# Altium schematic sheet 02_Top_Level.SchDoc: <Project Name>
size A3; ApprovedBy: <Appr.>; Author: <Author>; CompanyName: Infineon Technologies AG; Engineer: <Rel.>; Organization: Infineon Technologies AG; Address1: COM AC SDC SD3; Address2: Am Campeon 1-12  -  85579 Neubiberg  -  Germany; Address3: 85579 Neubiberg; Address4: Germany; DocumentNumber: 2; Revision: <Rev.>; SheetNumber: 2; SheetTotal: 9; Release: RC00; PageSetup: Record=PageOptions|CenterHorizontal=True|CenterVertical=True|PrintScale=1.01|XCorrection=1.00|YCorrection=1.00|PrintKind=0|BorderSize=5000000|LeftOffset=0|BottomOffset=0|Orientation=2|PaperLength=1000|PaperWidth=1000|Scale=100|PaperSource=7|PrintQuality=-4|MediaType=1|DitherType=10|PaperKind=A3|PrintScaleMode=1; Doc_ConfidentialStatus: <Doc_ConfidentialStatus>; Doc_Preliminary: <Doc_Preliminary>
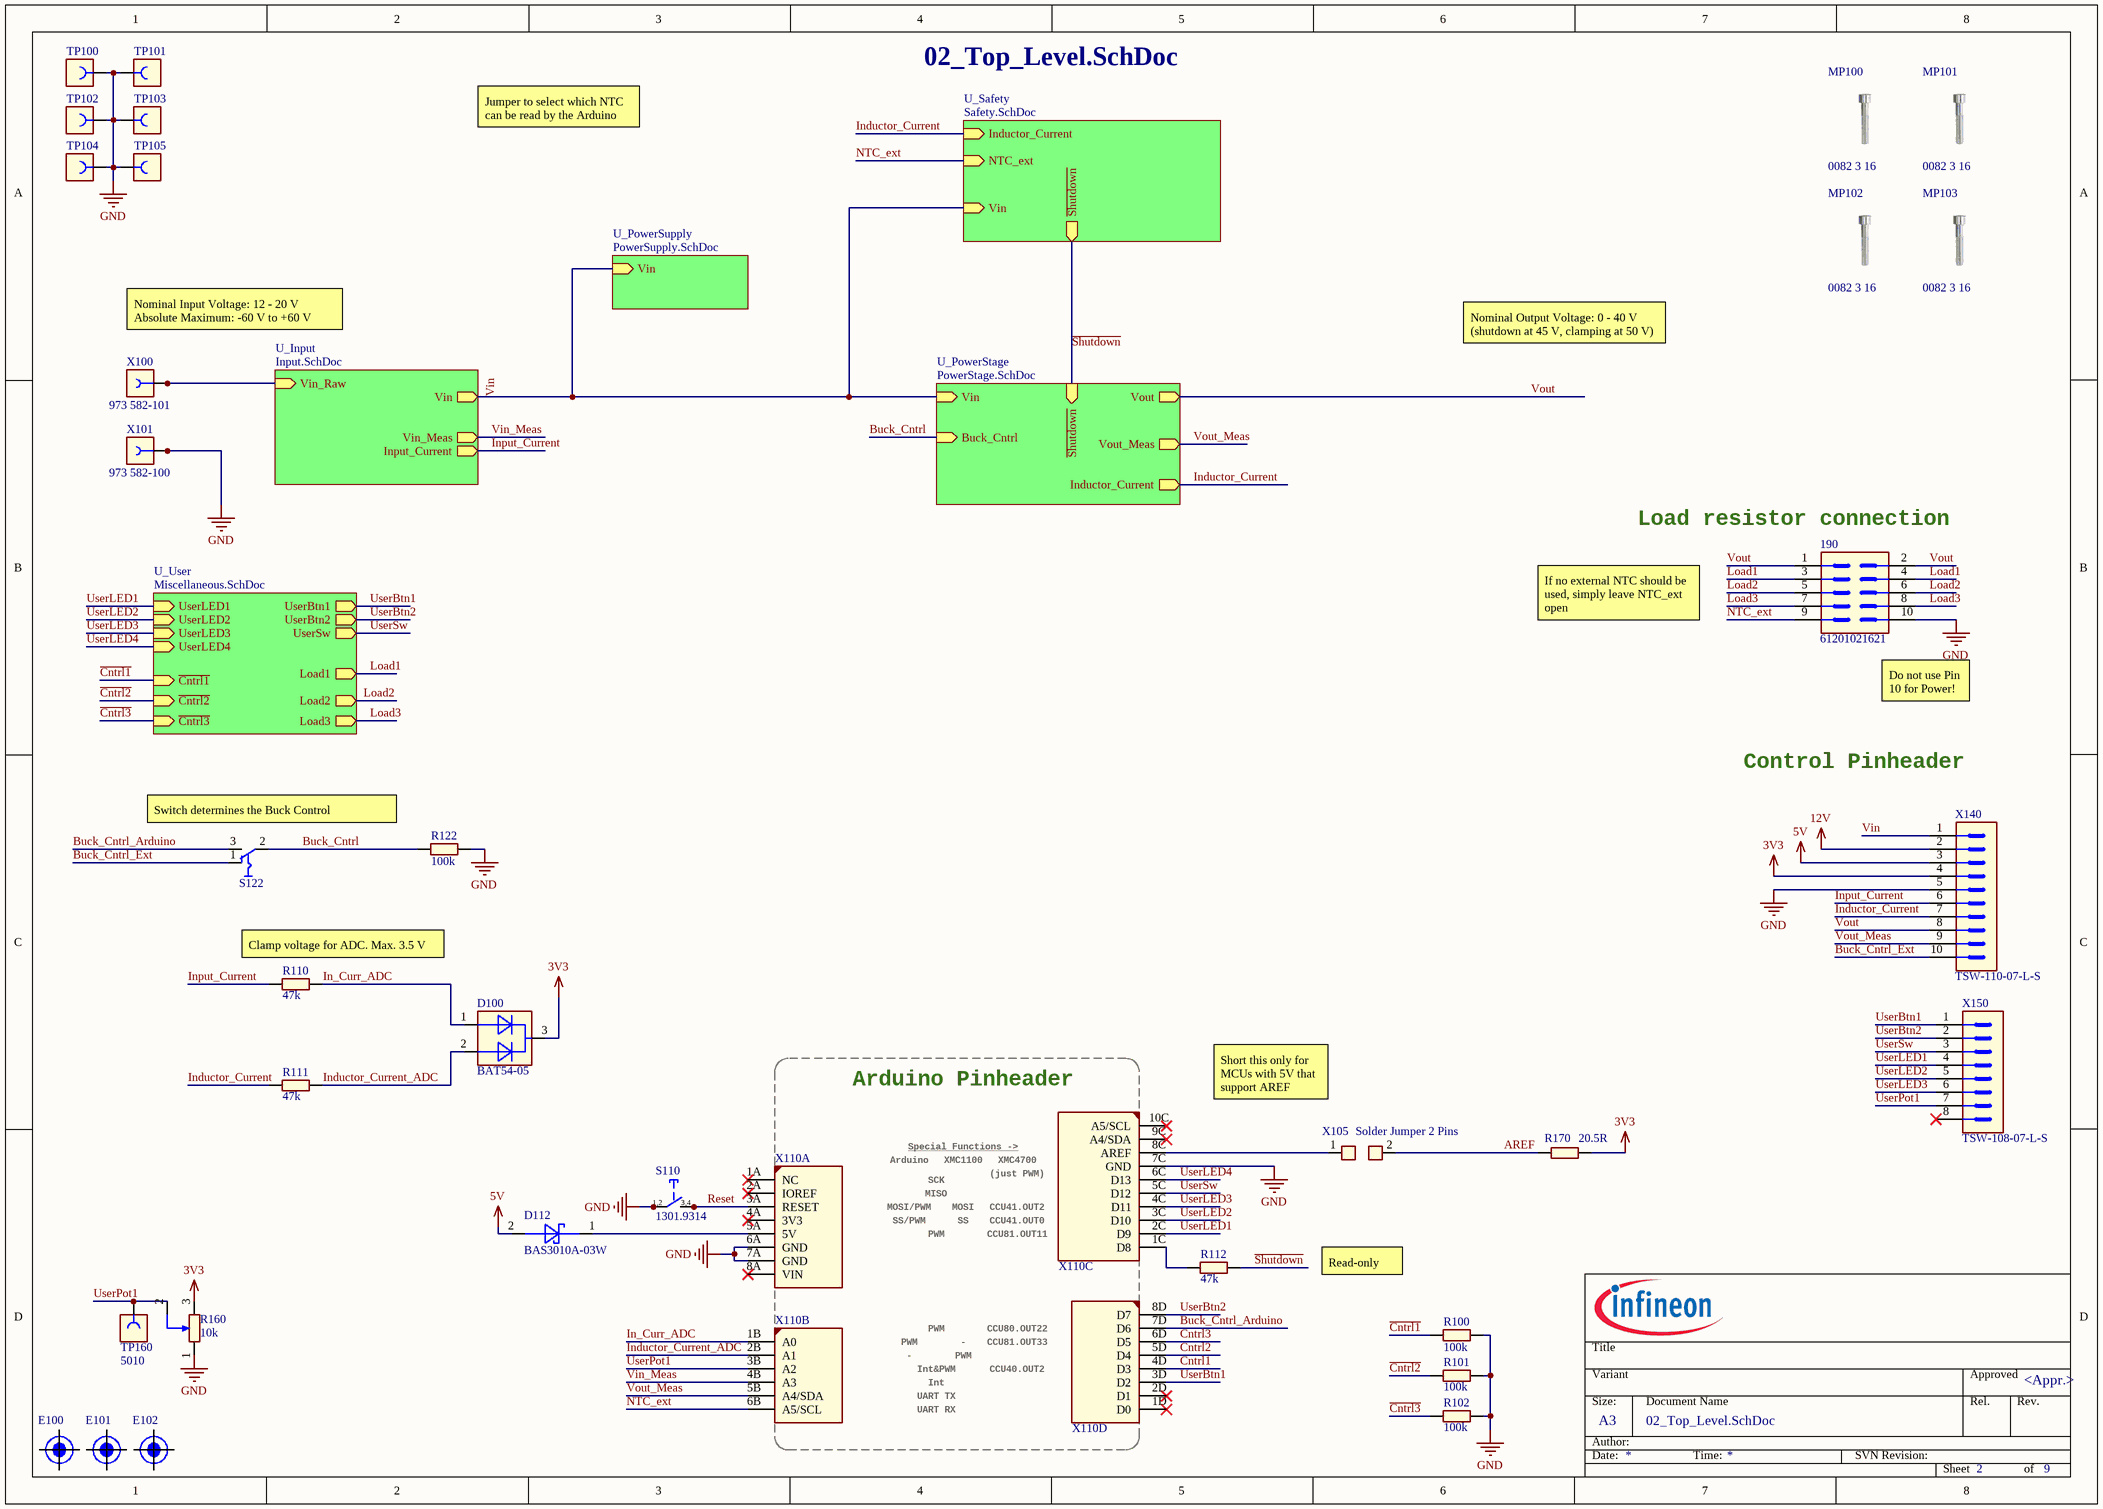
[diagram p0: 02_Top_Level.SchDoc]

## Parts
190  61201021621  [CON-M-THT-61201021621]
D100  BAT54-05  [SOT95P240X110-3N-1-V]
D112  BAS3010A-03W  [SOD2513X110N]
E100  (no value)  [fiducial]  (no BOM)
E101  (no value)  [fiducial]  (no BOM)
E102  (no value)  [fiducial]  (no BOM)
MP100  0082 3 16  [SCREW_0082 3 16_NPTH]
MP101  0082 3 16  [SCREW_0082 3 16_NPTH]
MP102  0082 3 16  [SCREW_0082 3 16_NPTH]
MP103  0082 3 16  [SCREW_0082 3 16_NPTH]
R100  100k  [RESC3216X60N]
R101  100k  [RESC3216X60N]
R102  100k  [RESC3216X60N]
R110  47k  [RESC3216X60N]
R111  47k  [RESC3216X60N]
R112  47k  [RESC3216X60N]
R122  100k  [RESC3216X60N]
R160  10k  [POT-THT-3362P]
R170  20.5R  [RESC3216X60N]
S110  1301.9314  [SW-SMD-1301.9314]
S122  CL-SB-12A-01T  [SW-SMD-CL-SB-12A-01T]  (value not drawn)
TP100  5011  [CON-THT-TP-5011]  (value not drawn)
TP101  5011  [CON-THT-TP-5011]  (value not drawn)
TP102  5011  [CON-THT-TP-5011]  (value not drawn)
TP103  5011  [CON-THT-TP-5011]  (value not drawn)
TP104  5011  [CON-THT-TP-5011]  (value not drawn)
TP105  5011  [CON-THT-TP-5011]  (value not drawn)
TP160  5010  [CON-THT-TP-5010]
X100  973 582-101  [CON-THT-973 582- 101]
X101  973 582-100  [CON-THT-973 582- 100]
X105  Solder Jumper 2 Pins  [SOLDER_BRIDGE_0.7X1.299PAD]
X110  Arduino-Uno  [Arduino-Uno]  (value not drawn)  (parts A,B,C,D of 4)
X140  TSW-110-07-L-S  [CON-M-THT-TSW-110-07-L-S]
X150  TSW-108-07-L-S  [CON-M-THT-TSW-108-07-L-S]

## Sub-sheets
U_Input = Input.SchDoc: Vin_Raw (in), Vin (out), Vin_Meas (out), Input_Current (out)
U_PowerStage = PowerStage.SchDoc: Vin (in), ~{Shutdown} (in), Buck_Cntrl (in), Vout (out), Inductor_Current (out), Vout_Meas (out)
U_PowerSupply = PowerSupply.SchDoc: Vin (in)
U_Safety = Safety.SchDoc: ~{Shutdown} (out), NTC_ext (in), Inductor_Current (in), Vin (in)
U_User = Miscellaneous.SchDoc: UserLED1 (in), UserLED2 (in), UserLED3 (in), UserLED4 (in), UserBtn1 (out), UserBtn2 (out), UserSw (out), Load3 (out), ~{Cntrl1} (in), ~{Cntrl3} (in), Load2 (out), Load1 (out), ~{Cntrl2} (in)

## Nets
3V3: D100.3(CATHODE) R160.3 R170.2 X140.4
5V: D112.2(Anode) X140.3
12V: X140.2
GND: 190.10 R100.2 R101.2 R102.2 R122.2 R160.1 S110.1 S110.2 TP100.1 TP101.1 TP102.1 TP103.1 TP104.1 TP105.1 X101.1 X101.2 X110.6A(GND) X110.7A(GND) X110.7C(GND) X140.5
~{Cntrl1}: R100.1 X110.4D(D3) ; sheet U_User/~{Cntrl1}
~{Cntrl2}: R101.1 X110.5D(D4) ; sheet U_User/~{Cntrl2}
~{Cntrl3}: R102.1 X110.6D(D5) ; sheet U_User/~{Cntrl3}
~{Shutdown}: R112.1 ; sheet U_PowerStage/~{Shutdown}, sheet U_Safety/~{Shutdown}
AREF: R170.1 X105.2
Buck_Cntrl: R122.1 S122.2 ; sheet U_PowerStage/Buck_Cntrl
Buck_Cntrl_Arduino: S122.3 X110.7D(D6)
Buck_Cntrl_Ext: S122.1 X140.10
In_Curr_ADC: D100.1(ANODE_1) R110.1 X110.1B(A0)
Inductor_Current: R111.2 X140.7 ; sheet U_PowerStage/Inductor_Current, sheet U_Safety/Inductor_Current
Inductor_Current_ADC: D100.2(ANODE_2) R111.1 X110.2B(A1)
Input_Current: R110.2 X140.6 ; sheet U_Input/Input_Current
Load1: 190.3 190.4 ; sheet U_User/Load1
Load2: 190.5 190.6 ; sheet U_User/Load2
Load3: 190.7 190.8 ; sheet U_User/Load3
NTC_ext: 190.9 X110.6B(A5/SCL) ; sheet U_Safety/NTC_ext
Reset: S110.3 S110.4 X110.3A(RESET)
UserBtn1: X110.3D(D2) X150.1 ; sheet U_User/UserBtn1
UserBtn2: X110.8D(D7) X150.2 ; sheet U_User/UserBtn2
UserLED1: X110.2C(D9) X150.4 ; sheet U_User/UserLED1
UserLED2: X110.3C(D10) X150.5 ; sheet U_User/UserLED2
UserLED3: X110.4C(D11) X150.6 ; sheet U_User/UserLED3
UserLED4: X110.6C(D13) ; sheet U_User/UserLED4
UserPot1: R160.2 TP160.1 X110.3B(A2) X150.7
UserSw: X110.5C(D12) X150.3 ; sheet U_User/UserSw
Vin: X140.1 ; sheet U_Input/Vin, sheet U_PowerStage/Vin, sheet U_PowerSupply/Vin, sheet U_Safety/Vin
Vin_Meas: X110.4B(A3) ; sheet U_Input/Vin_Meas
Vout: 190.1 190.2 X140.8 ; sheet U_PowerStage/Vout
Vout_Meas: X110.5B(A4/SDA) X140.9 ; sheet U_PowerStage/Vout_Meas
NetD112_1: D112.1(Cathode) X110.5A(5V)
NetR112_2: R112.2 X110.1C(D8)
NetX100_1: X100.1 X100.2 ; sheet U_Input/Vin_Raw
NetX105_1: X105.1 X110.8C(AREF)

Not connected (* = marked no-connect by the designer): E100 1; E101 1; E102 1; X110 1A(NC)* 1D(D0)* 2A(IOREF)* 2D(D1)* 4A(3V3)* 8A(VIN)* 9C(A4/SDA)* 10C(A5/SCL)*; X150 8*

## Notes on the sheet
- Jumper to select which NTC  can be read by the Arduino
- Nominal Input Voltage: 12 - 20 V
  Absolute Maximum: -60 V to +60 V
- Nominal Output Voltage: 0 - 40 V (shutdown at 45 V, clamping at 50 V)
- (near 190) Load resistor connection
- If no external NTC should be used, simply leave NTC_ext open
- (near 190) Do not use Pin 10 for Power!
- Control Pinheader
- Switch determines the Buck Control
- (near R110) Clamp voltage for ADC. Max. 3.5 V
- Arduino Pinheader
- Short this only for MCUs with 5V that support AREF
- Arduino
- SCK
- MISO
- Special Functions ->
- XMC1100
- XMC4700
- (just PWM)
- SS/PWM
- MOSI/PWM
- PWM
- MOSI
- SS
- CCU41.OUT0
- CCU41.OUT2
- CCU81.OUT11
- CCU80.OUT22
- Read-only
- -
- UART TX
- Int
- Int&PWM
- CCU81.OUT33
- CCU40.OUT2
- UART RX
- Title
- Variant
- Approved
- Date:
- Author:
- Size:
- A3
- Document Name
- Time:
- SVN Revision:
- Rel.
- Rev.
- Sheet
- of
- (in symbol 380147) 1,2; 3,4

## Library data of the parts
190 = 638630: WR-BHD Male Box Header, 2.54mm pitch, 10 pin, Vertical, Double row; Manufacturer: Wurth Elektronik; Article Number: 638630; Version Number: V01; Legacy DeviceID: WE_61201021621; Combined Parameters: Board-to-Board/Cable Header (male);5x2;Mounting:THT;Orient:0° (vertical);Shielded:No; QuickPick: 0° (vertical) / Board-to-Board/Cable; Style: Strip; Automotive Qualified: No; ComponentStatus: Released; PLMStatus: Active; Second Source allowed: Yes; Voltage DC (max): na; Part Type: Connector; Manufacturer Order Number: 61201021621; Value: 61201021621; Type: Board-to-Board/Cable; Temperature min: -40; Temperature max: 105; Temperature Range: Industrial; ROHS Compliant: Y; PackageReference: THT; ComponentLink1Description: Vendor WebSite; ComponentLink1URL: http://www.we-online.com; ComponentLink2Description: Datasheet; ComponentLink2URL: http://webnetprod.muc.infineon.com/PCBPortal_Prod/WorkFlows/AltiumComponent/StandardDocumentation?Versionid=638631; Supplier 1: Farnell; Supplier Part Number 1: 1642019; Supplier 2: DigiKey; Supplier Part Number 2: 732-2094-ND; Supplier 3: Mouser; Supplier Part Number 3: 710-61201021621; Package Description: Connector, THT, 2.54mm Pitch; 10 Pins, 9.10 mm L X 20.36 mm W X 9.25 mm H body
D100 = 430837: Silicon Schottky Diode, LS(nH) 1.8, VR 30V; Legacy PartNumber: IFX01401370; Manufacturer: Infineon Technologies; Symbol type: Dual Diode Symbol 3 Pins, 1 Anode, 2 Anode, 3 Cathode; Article Number: 430837; Version Number: V01; Combined Parameters: Vf:800mV;If:200mA;Ur:30V;Ir:2uA;Pmax:230mW; QuickPick: Schottky Diode / PG-SOT23-3-11; Style: Dual; Automotive Qualified: AEC Q101; ComponentStatus: Released; PLMStatus: Active; Second Source allowed: Yes; Voltage DC (max): na; Legacy DeviceID: IFX01401370; Part Type: Diode; Manufacturer Order Number: BAT54-05; Value: BAT54-05; Type: Schottky Diode; Application: Standard; Temperature min: 0; Temperature max: 150; Temperature Range: Military; ROHS Compliant: Y; PackageReference: PG-SOT23-3-11; ComponentLink1Description: Vendor WebSite; ComponentLink1URL: https://www.infineon.com/; ComponentLink2Description: Datasheet; ComponentLink2URL: http://webnetprod.muc.infineon.com/PCBPortal_Prod/WorkFlows/AltiumComponent/StandardDocumentation?Versionid=430838; Supplier 1: Farnell; Supplier Part Number 1: 2725759; Supplier 2: DigiKey; Supplier Part Number 2: BAT5405E6327HTSA1TR-ND; Supplier 3: Mouser; Supplier Part Number 3: 726-BAT5405E6327HTSA; Package Description: SOT,0.95mm pitch;3 pin,1.30mm W X 2.90mm L X 1.10mm H body
D112 = 420617: Medium Power AF Schottky Diode; Legacy PartNumber: IFX01400145; Manufacturer: Infineon Technologies; Symbol Type: Standard Schottky Diode Symbol, 1 Cathode, 2 Anode; Article Number: 420617; Version Number: V01; Combined Parameters: Vf:410mV;If:1A;Ur:30V;Ir:200uA;Pmax:-; QuickPick: Schottky Diode / SOD323; Style: Single; Automotive Qualified: AEC Q101; ComponentStatus: Released; PLMStatus: Active; Second Source allowed: Yes; Voltage DC (max): na; Legacy DeviceID: IFX01400145; Part Type: Diode; Manufacturer Order Number: BAS3010A-03W; Value: BAS3010A-03W; Type: Schottky Diode; Application: Standard; Temperature min: -65; Temperature max: 125; Temperature Range: Military; ROHS Compliant: Y; PackageReference: SOD323; ComponentLink1Description: Vendor WebSite; ComponentLink1URL: https://www.infineon.com/; ComponentLink2Description: Datasheet; ComponentLink2URL: http://webnetprod.muc.infineon.com/PCBPortal_Prod/WorkFlows/AltiumComponent/StandardDocumentation?Versionid=420618; Supplier 1: Farnell; Supplier 2: DigiKey; Supplier Part Number 2: BAS3010A03WE6327HTSA1TR-ND; Supplier 3: Mouser; Supplier Part Number 3: 726-BAS3010A-03WE6; Package Description: SOD323
E100-E102 = 416637: Fiducial Mark; Legacy PartNumber: MEC10000008; Manufacturer: Infineon Technologies; Alternate View: No; Symbol Type: Fiducial Marker For PCB; Article Number: 416637; Version Number: V01; Legacy DeviceID: MEC_Fiducial_Mark; Combined Parameters: - - -x- -; ComponentStatus: Released; PLMStatus: Active; Second Source allowed: Yes; Voltage DC (max): na; Multible Parts: No; Part Type: Mechanical; Temperature min: 0; Temperature max: 0; Temperature Range: Military; ComponentLink1Description: Vendor WebSite; ComponentLink1URL: https://www.infineon.com/; ComponentLink2Description: Datasheet; ComponentLink2URL: http://webnetprod.muc.infineon.com/PCBPortal_Prod/WorkFlows/AltiumComponent/StandardDocumentation?Versionid=416638; Supplier 1: Farnell; Supplier 2: DigiKey; Supplier 3: Mouser
MP100-MP103 = 455343: Cheese Head Screw With Hexagon Socket, DIN 912 (ISO 4762), M3, 16mm length; Legacy PartNumber: MEC10000167; Manufacturer: Wurth Elektronik; Alternate View: No; Symbol Type: Cheese-Head Screw, M2.5X5-DIN 912; Article Number: 455343; Version Number: V01; Legacy DeviceID: MEC_0082 3 16; Combined Parameters: Steel Hexagonal 19x5.68 Screw; Style: Hexagonal; ComponentStatus: Released; PLMStatus: Active; Second Source allowed: Yes; Voltage DC (max): na; Multiple Parts: No; Part Type: Mechanical; Manufacturer Order Number: 0082 3 16; Value: 0082 3 16; QuickPick: Screw; Type: Screw; Temperature min: 0; Temperature max: 0; Temperature Range: Military; ROHS Compliant: N; Automotive Qualified: No; PackageReference: THT; ComponentLink1Description: Vendor WebSite; ComponentLink1URL: http://www.we-online.com; ComponentLink2Description: Datasheet; ComponentLink2URL: http://webnetprod.muc.infineon.com/PCBPortal_Prod/WorkFlows/AltiumComponent/StandardDocumentation?Versionid=455344; Supplier 1: Farnell; Supplier 2: DigiKey; Supplier 3: Mouser; Package Description: M3 Cheese Head Screw X 5.68mm Head
R100-R102 R122 = 354752: RES / STD / 100k / 250mW / 1% / 100ppm/K / -55°C to 155°C / 1206(3216) / SMD / -; Multiple Parts: No; Legacy PartNumber: RES01802971; Manufacturer: Vishay; Manufacturer Order Number: CRCW1206100KFK; Symbol Type: Resistor; Single; Standard; 2 Pins; Alternate View: Yes; Article Number: 354752; Version Number: V01; Combined Parameters: TCR:100ppm/K;Tol.:-1%/+1%;Vdc:200V;Idc:-;P:250mW; QuickPick: 100k / 1% / 0.25 / 1206 (3216); Style: Single; Automotive Qualified: AEC Q200; Package Metric: 3216; Package Imperial: 1206; ComponentStatus: Released; PLMStatus: Active; Voltage DC (max): 200V; Legacy DeviceID: RES01802971; Part Type: Resistor; Value: 100k; Tolerance Neg: 1%; Tolerance Pos: 1%; Type: Standard; Technology: Thick Film; Temperature min: -55; Temperature max: 155; Temperature Range: Military; ROHS Compliant: Y; PackageReference: 1206 (3216); ComponentLink1Description: Vendor WebSite; ComponentLink1URL: http://www.vishay.com; ComponentLink2Description: Datasheet; ComponentLink2URL: http://webnetprod.muc.infineon.com/PCBPortal_Prod/WorkFlows/AltiumComponent/StandardDocumentation?Versionid=354753; Supplier 1: Farnell; Supplier 2: DigiKey; Supplier 3: Mouser; Second Source allowed: Yes
R110-R112 = 354562: RES / STD / 47k / 250mW / 1% / 100ppm/K / -55°C to 155°C / 1206(3216) / SMD / -; Multiple Parts: No; Legacy PartNumber: RES01802933; Manufacturer: Vishay; Manufacturer Order Number: CRCW120647K0FK; Symbol Type: Resistor; Single; Standard; 2 Pins; Alternate View: Yes; Article Number: 354562; Version Number: V01; Combined Parameters: TCR:100ppm/K;Tol.:-1%/+1%;Vdc:200V;Idc:-;P:250mW; QuickPick: 47k / 1% / 0.25 / 1206 (3216); Style: Single; Automotive Qualified: AEC Q200; Package Metric: 3216; Package Imperial: 1206; ComponentStatus: Released; PLMStatus: Active; Voltage DC (max): 200V; Legacy DeviceID: RES01802933; Part Type: Resistor; Value: 47k; Tolerance Neg: 1%; Tolerance Pos: 1%; Type: Standard; Technology: Thick Film; Temperature min: -55; Temperature max: 155; Temperature Range: Military; ROHS Compliant: Y; PackageReference: 1206 (3216); ComponentLink1Description: Vendor WebSite; ComponentLink1URL: http://www.vishay.com; ComponentLink2Description: Datasheet; ComponentLink2URL: http://webnetprod.muc.infineon.com/PCBPortal_Prod/WorkFlows/AltiumComponent/StandardDocumentation?Versionid=354563; Supplier 1: Farnell; Supplier 2: DigiKey; Supplier 3: Mouser; Second Source allowed: Yes
R160 = 647233: RES / VAR / 10k / 500mW / 10% / 100ppm/K / -55°C to 125°C / Potentiometer, THT, 2.54 mm pitch, 3 pin, 6.60 mm L X 6.99 mm W X 15.06 mm H body / THT / -; Multiple Parts: No; Manufacturer: Bourns; Manufacturer Order Number: 3362P-1-103T_LF; Alternate View: Yes; Symbol Type: Resistor; Single; Variable; 3 Pins; Article Number: 647233; Version Number: V01; Combined Parameters: TCR:100ppm/K;Tol.:-10%/+10%;Vdc:300V;Idc:-;P:500mW; QuickPick: 10k / 10% / 0.5 / THT; Style: Single; ComponentStatus: Released; PLMStatus: Active; Voltage DC (max): 300V; Part Type: Resistor; Value: 10k; Tolerance Neg: 10%; Tolerance Pos: 10%; Type: Variable; Application: Standard; Temperature min: -55; Temperature max: 125; Temperature Range: Military; ROHS Compliant: Y; Automotive Qualified: No; PackageReference: THT; ComponentLink1Description: Vendor WebSite; ComponentLink1URL: http://www.bourns.com; ComponentLink2Description: Datasheet; ComponentLink2URL: http://webnetprod.muc.infineon.com/PCBPortal_Prod/WorkFlows/AltiumComponent/StandardDocumentation?Versionid=647234; Supplier 1: Farnell; Supplier Part Number 1: 1739325; Supplier 2: DigiKey; Supplier Part Number 2: 3362P-103TLF-ND; Supplier 3: Mouser; Supplier Part Number 3: 652-3362P-1-103TLF; Second Source allowed: Yes; Package Description: Potentiometer, THT, 2.54 mm pitch, 3 pin, 6.60 mm L X 6.99 mm W X 15.06 mm H body
R170 = 352637: RES / STD / 20.5R / 250mW / 1% / 100ppm/K / -55°C to 155°C / 1206(3216) / SMD / -; Multiple Parts: No; Legacy PartNumber: RES01802548; Manufacturer: Vishay; Manufacturer Order Number: CRCW120620R5FK; Symbol Type: Resistor; Single; Standard; 2 Pins; Alternate View: Yes; Article Number: 352637; Version Number: V01; Combined Parameters: TCR:100ppm/K;Tol.:-1%/+1%;Vdc:200V;Idc:-;P:250mW; QuickPick: 20.5R / 1% / 0.25 / 1206 (3216); Style: Single; Automotive Qualified: AEC Q200; Package Metric: 3216; Package Imperial: 1206; ComponentStatus: Released; PLMStatus: Active; Voltage DC (max): 200V; Legacy DeviceID: RES01802548; Part Type: Resistor; Value: 20.5R; Tolerance Neg: 1%; Tolerance Pos: 1%; Type: Standard; Technology: Thick Film; Temperature min: -55; Temperature max: 155; Temperature Range: Military; ROHS Compliant: Y; PackageReference: 1206 (3216); ComponentLink1Description: Vendor WebSite; ComponentLink1URL: http://www.vishay.com; ComponentLink2Description: Datasheet; ComponentLink2URL: http://webnetprod.muc.infineon.com/PCBPortal_Prod/WorkFlows/AltiumComponent/StandardDocumentation?Versionid=352638; Supplier 1: Farnell; Supplier 2: DigiKey; Supplier 3: Mouser; Second Source allowed: Yes
S110 = 380147: Pushbutton Tactile Switch, Single Pole Single Throw, 4 Pins; Legacy PartNumber: CON01500305; Manufacturer: Schurter; Symbol type: Tactile Switch, Spring Return, Single Pole Single Throw - Normally Open, 4 Pins; Article Number: 380147; Version Number: V01; Legacy DeviceID: SCH_1301.9314; ComponentStatus: Released; PLMStatus: Active; Second Source allowed: Yes; Voltage DC (max): na; Part Type: Electro Mechanic; Manufacturer Order Number: 1301.9314; Value: 1301.9314; Temperature min: -20; Temperature max: 70; Temperature Range: Commercial; ROHS Compliant: Y; ComponentLink1Description: Vendor WebSite; ComponentLink1URL: http://www.schurter.com.sg/; ComponentLink2Description: Datasheet; ComponentLink2URL: http://webnetprod.muc.infineon.com/PCBPortal_Prod/WorkFlows/AltiumComponent/StandardDocumentation?Versionid=380148; Supplier 1: Farnell; Supplier Part Number 1: 1217763; Supplier 2: DigiKey; Supplier Part Number 2: 1301.9314-ND; Supplier 3: Mouser; Supplier Part Number 3: 693-1301.9314; Package Description: SMD Switch, 6.00mm L X 6.00mm W X 4.3mm H body
S122 = 650099: Slid Switch, 12V, 200mA; Manufacturer: NIDEC COPAL ELECTRONICS, Inc.; Symbol Type: Switch, 2 Change Over 1 3, 3 Pins; Article Number: 650099; Version Number: V00; Automotive Qualified: No; ComponentStatus: Released; PLMStatus: Active; Second Source allowed: Yes; Voltage DC (max): na; Part Type: Electro Mechanic; Manufacturer Order Number: CL-SB-12A-01T; Value: CL-SB-12A-01T; Application: Power; Temperature min: -40; Temperature max: 85; Temperature Range: Industrial; ROHS Compliant: Y; ComponentLink1Description: Vendor WebSite; ComponentLink1URL: www.copal-electronics.com/; ComponentLink2Description: Datasheet; ComponentLink2URL: http://webnetprod.muc.infineon.com/PCBPortal_Prod/WorkFlows/AltiumComponent/StandardDocumentation?Versionid=650100; Supplier 1: Farnell; Supplier Part Number 1: 2854744; Supplier 2: DigiKey; Supplier Part Number 2: 563-1314-1-ND; Supplier 3: Mouser; Supplier Part Number 3: 229-CL-SB-12A-01T; Package Description: Switch, SMD, 3 Pins, 3.50 mm W X 8.50 mm L X 6.10 mm H body
TP100-TP105 = 382410: PC Test Point-Multipurpose THT, Black; Multiple Parts: No; Legacy PartNumber: CON01500530; Manufacturer: Keystone Electronics Corp.; Symbol Type: Connector, 1 Lead, Female; Alternate View: Yes; Article Number: 382410; Version Number: V01; Legacy DeviceID: KEY_5011; Combined Parameters: Board-to-Cable None (onboard);1x1;Mounting:THT;Orient:0° (vertical);Shielded:No; QuickPick: 0° (vertical) / Board-to-Cable; Style: Not Applicable; ComponentStatus: Released; PLMStatus: Active; Voltage DC (max): na; Part Type: Connector; Manufacturer Order Number: 5011; Value: 5011; Type: Board-to-Cable; Application: Test; Temperature min: 0; Temperature max: 0; Temperature Range: Military; ROHS Compliant: Y; Automotive Qualified: No; ComponentLink1Description: Vendor WebSite; ComponentLink1URL: http://www.keyelco.com/; ComponentLink2Description: Datasheet; ComponentLink2URL: http://webnetprod.muc.infineon.com/PCBPortal_Prod/WorkFlows/AltiumComponent/StandardDocumentation?Versionid=382411; Supplier 1: Farnell; Supplier Part Number 1: 2431148; Supplier 2: DigiKey; Supplier Part Number 2: 36-5011-ND; Supplier 3: Mouser; Supplier Part Number 3: 534-5011; Second Source allowed: Yes; Package Description: Test Point, 1.78 mm Lead Width, Round, 3.17 mm Dia X 8.28 mm H body
TP160 = 382400: PC Test Point-Multipurpose THT, Red; Multiple Parts: No; Legacy PartNumber: CON01500529; Manufacturer: Keystone Electronics Corp.; Symbol Type: Connector, 1 Lead, Female; Alternate View: Yes; Article Number: 382400; Version Number: V01; Legacy DeviceID: KEY_5010; Combined Parameters: Board-to-Cable None (onboard);1x1;Mounting:THT;Orient:0° (vertical);Shielded:No; QuickPick: 0° (vertical) / Board-to-Cable; Style: Not Applicable; ComponentStatus: Released; PLMStatus: Active; Voltage DC (max): na; Part Type: Connector; Manufacturer Order Number: 5010; Value: 5010; Type: Board-to-Cable; Application: Test; Temperature min: 0; Temperature max: 0; Temperature Range: Military; ROHS Compliant: Y; Automotive Qualified: No; ComponentLink1Description: Vendor WebSite; ComponentLink1URL: http://www.keyelco.com/; ComponentLink2Description: Datasheet; ComponentLink2URL: http://webnetprod.muc.infineon.com/PCBPortal_Prod/WorkFlows/AltiumComponent/StandardDocumentation?Versionid=382401; Supplier 1: Farnell; Supplier Part Number 1: 2301288; Supplier 2: DigiKey; Supplier Part Number 2: 36-5010-ND; Supplier 3: Mouser; Supplier Part Number 3: 534-5010; Second Source allowed: Yes; Package Description: Test Point, 1.78 mm Lead Width, Round, 3.17 mm Dia X 8.28 mm H body
X100 = 377341: Banana Socket, Red, 17.5mm Pitch; Legacy PartNumber: CON01500041; Manufacturer: Hirschmann Test & Measurement; Manufacturer Component Status: Active; Symbol Type: Banana Socket 2 Pins; Article Number: 377341; Version Number: V01; Legacy DeviceID: HTM_973 582- 101; Combined Parameters: Board-to-Cable Socket (female);2x1;Mounting:THT;Orient:90° (right angle);Shielded:No; QuickPick: 90° (right angle) / Board-to-Cable; ComponentStatus: Released; Second Source allowed: Yes; Voltage DC (max): na; Part Type: Connector; Manufacturer Order Number: 973 582-101; Value: 973 582-101; Type: Board-to-Cable; Style: Banana; Temperature min: -25; Temperature max: 85; Temperature Range: Military; ROHS Compliant: N; ComponentLink1Description: Vendor WebSite; ComponentLink1URL: http://www.sks-kontakt.de/; ComponentLink2Description: Datasheet; ComponentLink2URL: http://webnetprod.muc.infineon.com/PCBPortal_Prod/WorkFlows/AltiumComponent/StandardDocumentation?Versionid=377342; Supplier 1: Farnell; Supplier Part Number 1: 497332; Supplier 2: DigiKey; Supplier 3: Mouser; Supplier Part Number 3: 845-973582101; PLMStatus: Active; Package Description: Banana Jack, 2 pins, 17.5mm Pitch, 21mm L X 7.5mm W X 10.5mm H body
X101 = 377401: Banana Socket, black, 17.5mm Pitch; Legacy PartNumber: CON01500045; Manufacturer: Hirschmann Test & Measurement; Manufacturer Component Status: Active; Symbol Type: Banana Socket 2 Pins; Article Number: 377401; Version Number: V01; Legacy DeviceID: HTM_973 582- 100; Combined Parameters: Board-to-Cable Socket (female);-x-;Mounting:THT;Orient:90° (right angle);Shielded:No; QuickPick: 90° (right angle) / Board-to-Cable; Automotive Qualified: No; ComponentStatus: Released; Second Source allowed: Yes; Voltage DC (max): na; Part Type: Connector; Manufacturer Order Number: 973 582-100; Value: 973 582-100; Type: Board-to-Cable; Style: Banana; Temperature min: -25; Temperature max: 85; Temperature Range: Military; ROHS Compliant: N; ComponentLink1Description: Vendor WebSite; ComponentLink1URL: http://www.sks-kontakt.de/; ComponentLink2Description: Datasheet; ComponentLink2URL: http://webnetprod.muc.infineon.com/PCBPortal_Prod/WorkFlows/AltiumComponent/StandardDocumentation?Versionid=377402; Supplier 1: Farnell; Supplier Part Number 1: 497344; Supplier 2: DigiKey; Supplier 3: Mouser; Supplier Part Number 3: 845-973582100; PLMStatus: Active; Package Description: Banana Jack, 2 pins, 17.5mm Pitch, 21mm L X 7.5mm W X 10.5mm H body
X105 = 433601: Multiple Parts: No; Legacy PartNumber: CON01500959; Manufacturer: Infineon Technologies; Alternate View: Yes; Article Number: 433601; Version Number: V01; Legacy DeviceID: IFX_Solder Jumper 2 Pins; Combined Parameters: - None (onboard);2x1;Mounting:SMT;Orient:None (onboard);Shielded:No; QuickPick: None (onboard); Style: Not Applicable; ComponentStatus: Released; PLMStatus: Active; Voltage DC (max): na; Symbol Type: Solder Jumper 2 Pins; Part Type: Connector; Manufacturer Order Number: Solder Jumper 2 Pins; Value: Solder Jumper 2 Pins; Temperature min: 0; Temperature max: 0; Temperature Range: Military; ROHS Compliant: N; Automotive Qualified: No; ComponentLink1Description: Vendor WebSite; ComponentLink1URL: https://www.infineon.com/; ComponentLink2Description: Datasheet; Supplier 1: Farnell; Supplier 2: DigiKey; Supplier 3: Mouser; Second Source allowed: Yes; Package Description: Solder Bridge 2 Pins, 0.7X1.299mm Pad, 1.6mm L X 1.2mm W body
X110 = 644888: Arduino Uno is a microcontroller board based on the ATmega328P; Manufacturer: Infineon Technologies; Alternate View: Yes; Article Number: 644888; Version Number: V01; Legacy DeviceID: Infineon_Arduino-Uno; Combined Parameters: Board-to-Board Socket (female);-x-;Mounting:THT;Orient:0° (vertical);Shielded:-; QuickPick: 0° (vertical) / Board-to-Board; Automotive Qualified: No; ComponentStatus: Released; PLMStatus: Active; Voltage DC (max): na; Symbol Type: Arduino Uno is a microcontroller board based on the ATmega328P; Multiple Parts: Yes; Part Type: Connector; Manufacturer Order Number: Arduino-Uno; Value: Arduino-Uno; Type: Board-to-Board; Temperature min: -40; Temperature max: 85; Temperature Range: Industrial; ROHS Compliant: N; PackageReference: THT; ComponentLink1Description: Vendor WebSite; ComponentLink1URL: https://www.infineon.com/; ComponentLink2Description: Datasheet; Supplier 1: Farnell; Supplier 2: DigiKey; Supplier 3: Mouser; Second Source allowed: Yes; Package Description: Arduino-Uno, THT, 32 Pin, 68.58 mm L X 53.34 mm W X 8.64 mm H body
X140 = 382944: Through hole .025 SQ Post Header, 2.54mm pitch, 10 pin, vertical, single row; Legacy PartNumber: CON01500578; Manufacturer: Samtec; Symbol Type: Header 10 pins; Article Number: 382944; Version Number: V01; Legacy DeviceID: SAM_TSW-110-07-L-S; Combined Parameters: Board-to-Board Header (male);10x1;Mounting:THT;Orient:0° (vertical);Shielded:No; QuickPick: 0° (vertical) / Board-to-Board; Style: Strip; Automotive Qualified: No; ComponentStatus: Released; PLMStatus: Active; Second Source allowed: Yes; Voltage DC (max): na; Part Type: Connector; Manufacturer Order Number: TSW-110-07-L-S; Value: TSW-110-07-L-S; Type: Board-to-Board; Temperature min: -55; Temperature max: 125; Temperature Range: Military; ROHS Compliant: Y; ComponentLink1Description: Vendor WebSite; ComponentLink1URL: http://www.samtec.com/; ComponentLink2Description: Datasheet; ComponentLink2URL: http://webnetprod.muc.infineon.com/PCBPortal_Prod/WorkFlows/AltiumComponent/StandardDocumentation?Versionid=382945; Supplier 1: Farnell; Supplier Part Number 1: 2035612; Supplier 2: DigiKey; Supplier Part Number 2: SAM1031-10-ND; Supplier 3: Mouser; Package Description: Header,vertical,2.54mm pitch;0.64mm lead width,10 pins,1 row,10 pins per row,25.40mm L X 2.54mm W X 8.636mm H body
X150 = 382934: Through hole .025 SQ Post Header, 2.54mm pitch, 8 pin, vertical, single row; Legacy PartNumber: CON01500577; Manufacturer: Samtec; Symbol type: Header 8 Pins; Article Number: 382934; Version Number: V01; Legacy DeviceID: SAM_TSW-108-07-L-S; Combined Parameters: Board-to-Board Header (male);8x1;Mounting:THT;Orient:0° (vertical);Shielded:No; QuickPick: 0° (vertical) / Board-to-Board; Style: Strip; Automotive Qualified: No; ComponentStatus: Released; PLMStatus: Active; Second Source allowed: Yes; Voltage DC (max): na; Part Type: Connector; Manufacturer Order Number: TSW-108-07-L-S; Value: TSW-108-07-L-S; Type: Board-to-Board; Temperature min: -55; Temperature max: 125; Temperature Range: Military; ROHS Compliant: Y; ComponentLink1Description: Vendor WebSite; ComponentLink1URL: http://www.samtec.com/; ComponentLink2Description: Datasheet; ComponentLink2URL: http://webnetprod.muc.infineon.com/PCBPortal_Prod/WorkFlows/AltiumComponent/StandardDocumentation?Versionid=382935; Supplier 1: Farnell; Supplier Part Number 1: 2035610; Supplier 2: DigiKey; Supplier Part Number 2: SAM1031-08-ND; Supplier 3: Mouser; Package Description: Header,vertical,2.54mm pitch;0.64mm lead width,8 pins,1 row,8 pins per row,20.32mm L X 2.54mm W X 8.636mm H body